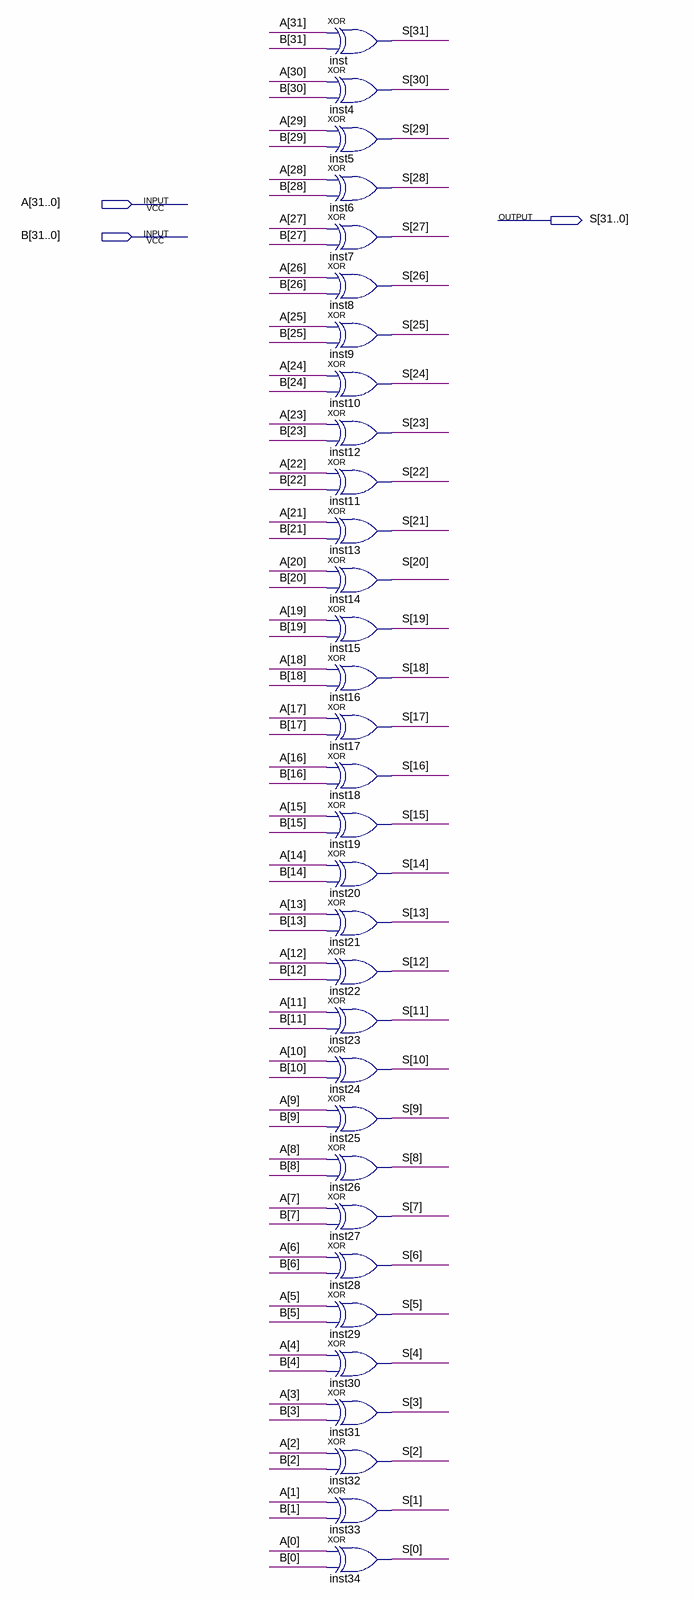
[diagram p0: schematic sheet]
// Quartus schematic xor32.bdf as structural Verilog: 32 symbols, 3 pins
module xor32 (
  input  [31:0] A,
  input  [31:0] B,
  output [31:0] S
);

  xor inst (S[31], A[31], B[31]);
  xor inst4 (S[30], A[30], B[30]);
  xor inst5 (S[29], A[29], B[29]);
  xor inst6 (S[28], A[28], B[28]);
  xor inst7 (S[27], A[27], B[27]);
  xor inst8 (S[26], A[26], B[26]);
  xor inst9 (S[25], A[25], B[25]);
  xor inst10 (S[24], A[24], B[24]);
  xor inst12 (S[23], A[23], B[23]);
  xor inst11 (S[22], A[22], B[22]);
  xor inst13 (S[21], A[21], B[21]);
  xor inst14 (S[20], A[20], B[20]);
  xor inst15 (S[19], A[19], B[19]);
  xor inst16 (S[18], A[18], B[18]);
  xor inst17 (S[17], A[17], B[17]);
  xor inst18 (S[16], A[16], B[16]);
  xor inst19 (S[15], A[15], B[15]);
  xor inst20 (S[14], A[14], B[14]);
  xor inst21 (S[13], A[13], B[13]);
  xor inst22 (S[12], A[12], B[12]);
  xor inst23 (S[11], A[11], B[11]);
  xor inst24 (S[10], A[10], B[10]);
  xor inst25 (S[9], A[9], B[9]);
  xor inst26 (S[8], A[8], B[8]);
  xor inst27 (S[7], A[7], B[7]);
  xor inst28 (S[6], A[6], B[6]);
  xor inst29 (S[5], A[5], B[5]);
  xor inst30 (S[4], A[4], B[4]);
  xor inst31 (S[3], A[3], B[3]);
  xor inst32 (S[2], A[2], B[2]);
  xor inst33 (S[1], A[1], B[1]);
  xor inst34 (S[0], A[0], B[0]);
endmodule
